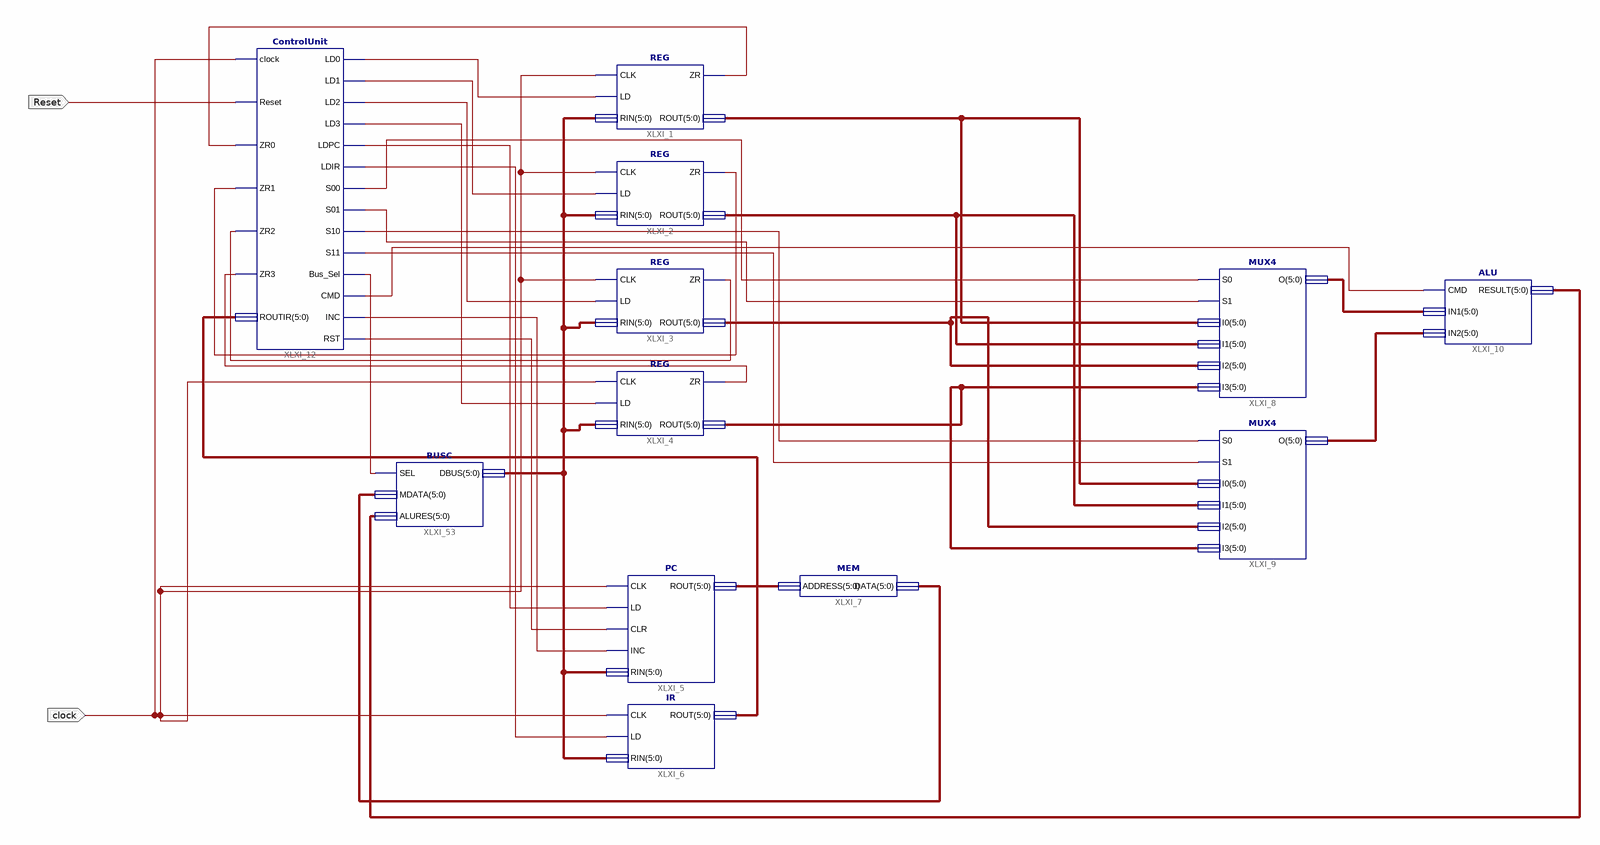
[diagram p0: schematic sheet 1]
// Xilinx ISE schematic CPU2.sch (spartan3) as structural Verilog: 12 symbols, 2 ports
module CPU2 (
  input  Reset,
  input  clock
);

  wire XLXN_16, XLXN_39, XLXN_40, XLXN_41, XLXN_42, XLXN_43, XLXN_44, XLXN_45, XLXN_46, XLXN_47, XLXN_48,
       XLXN_49, XLXN_50, XLXN_51, XLXN_52, XLXN_53, XLXN_54, XLXN_55;
  wire [5:0] XLXN_7, XLXN_12, XLXN_15, XLXN_56, XLXN_57, XLXN_58, XLXN_59, XLXN_60, XLXN_62, XLXN_63, XLXN_72;

  ControlUnit XLXI_12 (
    .clock(clock), .Reset(Reset), .ZR0(XLXN_52), .ZR1(XLXN_53), .ZR2(XLXN_54), .ZR3(XLXN_55),
    .ROUTIR(XLXN_56), .LD0(XLXN_39), .LD1(XLXN_40), .LD2(XLXN_41), .LD3(XLXN_42), .LDPC(XLXN_43),
    .LDIR(XLXN_44), .S00(XLXN_48), .S01(XLXN_49), .S10(XLXN_50), .S11(XLXN_51), .Bus_Sel(XLXN_16),
    .CMD(XLXN_45), .INC(XLXN_46), .RST(XLXN_47));
  PC XLXI_5 (.CLK(clock), .LD(XLXN_43), .CLR(XLXN_47), .INC(XLXN_46), .RIN(XLXN_72), .ROUT(XLXN_7));
  IR XLXI_6 (.CLK(clock), .LD(XLXN_44), .RIN(XLXN_72), .ROUT(XLXN_56));
  MEM XLXI_7 (.ADDRESS(XLXN_7), .DATA(XLXN_12));
  MUX4 XLXI_8 (.S0(XLXN_48), .S1(XLXN_49), .I0(XLXN_57), .I1(XLXN_58), .I2(XLXN_59), .I3(XLXN_60), .O(XLXN_62));
  MUX4 XLXI_9 (.S0(XLXN_50), .S1(XLXN_51), .I0(XLXN_57), .I1(XLXN_58), .I2(XLXN_59), .I3(XLXN_60), .O(XLXN_63));
  ALU XLXI_10 (.CMD(XLXN_45), .IN1(XLXN_62), .IN2(XLXN_63), .RESULT(XLXN_15));
  BUSC XLXI_53 (.SEL(XLXN_16), .MDATA(XLXN_12), .ALURES(XLXN_15), .DBUS(XLXN_72));
  REG XLXI_1 (.CLK(clock), .LD(XLXN_39), .RIN(XLXN_72), .ZR(XLXN_52), .ROUT(XLXN_57));
  REG XLXI_2 (.CLK(clock), .LD(XLXN_40), .RIN(XLXN_72), .ZR(XLXN_53), .ROUT(XLXN_58));
  REG XLXI_3 (.CLK(clock), .LD(XLXN_41), .RIN(XLXN_72), .ZR(XLXN_54), .ROUT(XLXN_59));
  REG XLXI_4 (.CLK(clock), .LD(XLXN_42), .RIN(XLXN_72), .ZR(XLXN_55), .ROUT(XLXN_60));
endmodule
